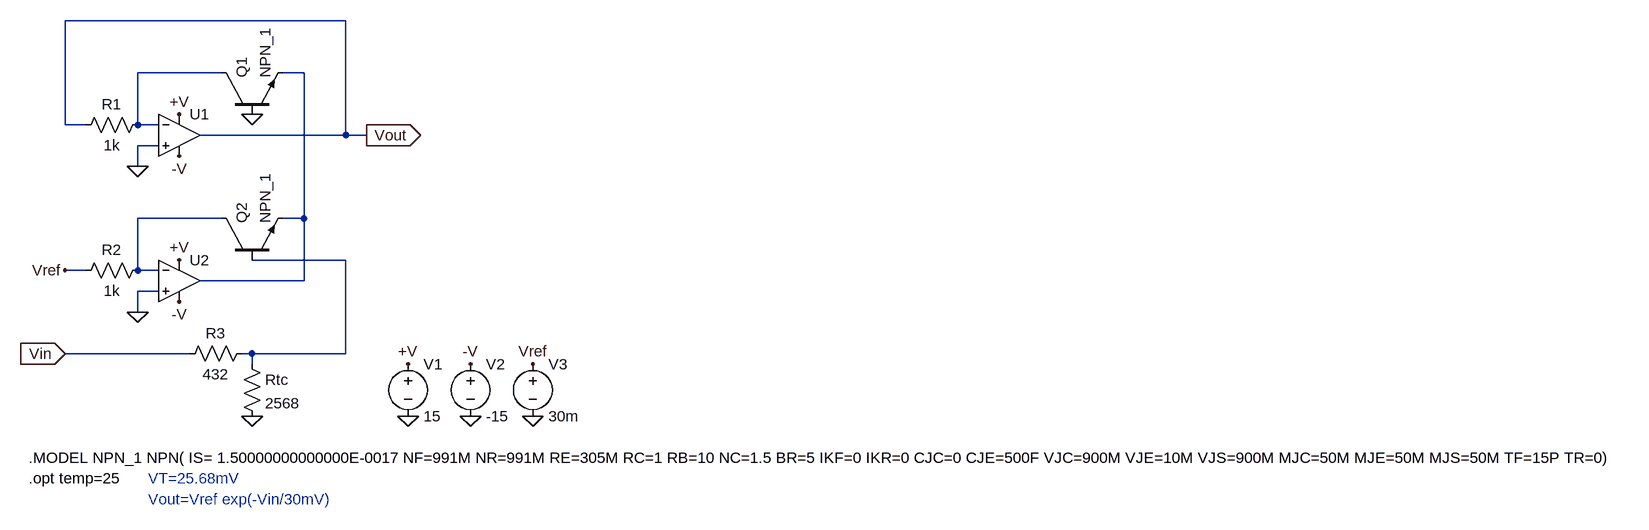
[diagram p0: schematic expamp.asc]
expamp.asc, the LTspice schematic file:
Version 4
SHEET 1 2660 960
WIRE 336 -64 -96 -64
WIRE 144 16 16 16
WIRE 272 16 240 16
WIRE -96 96 -96 -64
WIRE -64 96 -96 96
WIRE 16 96 16 16
WIRE 48 96 16 96
WIRE 336 112 336 -64
WIRE 336 112 112 112
WIRE 368 112 336 112
WIRE 48 128 16 128
WIRE 16 160 16 128
WIRE 144 240 16 240
WIRE 272 240 272 16
WIRE 272 240 240 240
WIRE 336 304 192 304
WIRE -64 320 -96 320
WIRE 16 320 16 240
WIRE 48 320 16 320
WIRE 272 336 272 240
WIRE 272 336 112 336
WIRE 48 352 16 352
WIRE 16 384 16 352
WIRE 96 448 -96 448
WIRE 192 448 176 448
WIRE 336 448 336 304
WIRE 336 448 192 448
WIRE 192 464 192 448
FLAG 432 544 0
FLAG 528 544 0
FLAG 432 464 +V
FLAG 80 80 +V
FLAG 528 464 -V
FLAG 80 144 -V
FLAG 16 160 0
FLAG 192 80 0
FLAG 80 304 +V
FLAG 80 368 -V
FLAG 16 384 0
FLAG 368 112 Vout
IOPIN 368 112 Out
FLAG 192 544 0
FLAG -96 448 Vin
IOPIN -96 448 In
FLAG 624 544 0
FLAG 624 464 Vref
FLAG -96 320 Vref
SYMBOL npn 144 80 R270
SYMATTR InstName Q1
SYMATTR Value NPN_1
SYMBOL voltage 432 448 R0
WINDOW 123 0 0 Left 0
WINDOW 39 0 0 Left 0
SYMATTR InstName V1
SYMATTR Value 15
SYMBOL voltage 528 448 R0
WINDOW 123 0 0 Left 0
WINDOW 39 0 0 Left 0
SYMATTR InstName V2
SYMATTR Value -15
SYMBOL res 32 80 R90
WINDOW 0 0 56 VBottom 2
WINDOW 3 32 56 VTop 2
SYMATTR InstName R1
SYMATTR Value 1k
SYMBOL npn 144 304 R270
SYMATTR InstName Q2
SYMATTR Value NPN_1
SYMBOL res 32 304 R90
WINDOW 0 0 56 VBottom 2
WINDOW 3 32 56 VTop 2
SYMATTR InstName R2
SYMATTR Value 1k
SYMBOL res 176 448 R0
SYMATTR InstName Rtc
SYMATTR Value 2568
SYMBOL res 192 432 R90
WINDOW 0 0 56 VBottom 2
WINDOW 3 32 56 VTop 2
SYMATTR InstName R3
SYMATTR Value 432
SYMBOL voltage 624 448 R0
WINDOW 123 0 0 Left 0
WINDOW 39 0 0 Left 0
SYMATTR InstName V3
SYMATTR Value 30m
SYMBOL OpAmps\\UniversalOpAmp1 80 112 R0
SYMATTR InstName U1
SYMATTR Value2 Avol=1Meg GBW=10g Vos=0
SYMBOL OpAmps\\UniversalOpAmp1 80 336 R0
SYMATTR InstName U2
SYMATTR Value2 Avol=1Meg GBW=10g Vos=0
TEXT -152 608 Left 2 !.MODEL NPN_1 NPN( IS= 1.50000000000000E-0017 NF=991M NR=991M RE=305M RC=1 RB=10 NC=1.5 BR=5 IKF=0 IKR=0 CJC=0 CJE=500F VJC=900M VJE=10M VJS=900M MJC=50M MJE=50M MJS=50M TF=15P TR=0)
TEXT -152 640 Left 2 !.opt temp=25
TEXT 32 640 Left 2 ;VT=25.68mV
TEXT 32 672 Left 2 ;Vout=Vref exp(-Vin/30mV)

The netlist it stands for:
* expamp.asc
Q1 N001 0 N002 0 NPN_1
V1 +V 0 15
V2 -V 0 -15
R1 N001 Vout 1k
Q2 N003 N004 N002 0 NPN_1
R2 N003 Vref 1k
Rtc N004 0 2568
R3 N004 Vin 432
V3 Vref 0 30m
XU1 0 N001 +V -V Vout level1 Avol=1Meg GBW=10g Vos=0 En=0 Enk=0 In=0 Ink=0 Rin=500Meg  ; pins In+ In- V+ V- OUT
XU2 0 N003 +V -V N002 level1 Avol=1Meg GBW=10g Vos=0 En=0 Enk=0 In=0 Ink=0 Rin=500Meg  ; pins In+ In- V+ V- OUT
.model NPN NPN
.model PNP PNP
.lib standard.bjt
.MODEL NPN_1 NPN( IS= 1.50000000000000E-0017 NF=991M NR=991M RE=305M RC=1 RB=10 NC=1.5 BR=5 IKF=0 IKR=0 CJC=0 CJE=500F VJC=900M VJE=10M VJS=900M MJC=50M MJE=50M MJS=50M TF=15P TR=0)
.opt temp=25
* VT=25.68mV
* Vout=Vref exp(-Vin/30mV)
.lib UniversalOpAmp1.lib
.backanno
.end